# Altium project PCB_Project.PrjPcb
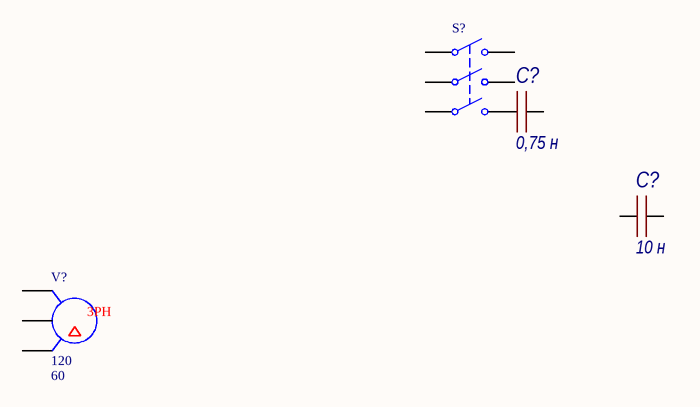
[diagram p0: Sheet1.SchDoc]
1 sheet, 4 parts. Net scope: global (net labels, ports and power ports of the same name join across sheets).

## Sheet Sheet1.SchDoc
size A4; SheetNumber: 1; SheetTotal: 1

### Parts
(Parts that share a designator on the sheet are numbered #1, #2 ... from top to bottom, then left to right.)
C?#1  value 0,75 н  [0603C]  (hidden comment: Capacitor)
C?#2  value 10 н  [0603C]  (hidden comment: Capacitor)
S?  Triple-Pole, Single-Throw Switch  (value not drawn)
V?  V_RMS: 120  FREQ: 60  (hidden comment: 3-Phase Delta Voltage Source)

### Nets

Not connected (* = marked no-connect by the designer): C?#1 1 2; C?#2 1 2; S? 1 2 3 4 5 6; V? 1 2 3

### Notes on the sheet
- (in symbol 3 Phase Delta) 3PH

### Library data of the parts
C?#1 = Capacitor_0,75n_10_50V_X7R_0603C: Конденсатор 0603C ёмкостью 0,75 н 10%, 50 В, X7R; Library Path2: Schematic\Capacitor.SchLib; Voltage (V): 50; Capacity (nF): 0,75; Part Number: Capacitor_0,75n_10_50V_X7R_0603C; Tolerance: 10%; Dielectric: X7R
C?#2 = Capacitor_10n_10_50V_X7R_0603C: Конденсатор 0603C ёмкостью 10 н 10%, 50 В, X7R; Library Path2: Schematic\Capacitor.SchLib; Voltage (V): 50; Capacity (nF): 10; Part Number: Capacitor_10n_10_50V_X7R_0603C; Tolerance: 10%; Dielectric: X7R
S? = 3PST: SimulationGenericComponent: True; closed: 0; Rclosed: 1m; Ropen: 1Meg
V? = 3 Phase Delta: SimulationGenericComponent: True